# EAGLE design Matrix_keyboard (EAGLE 6.2)
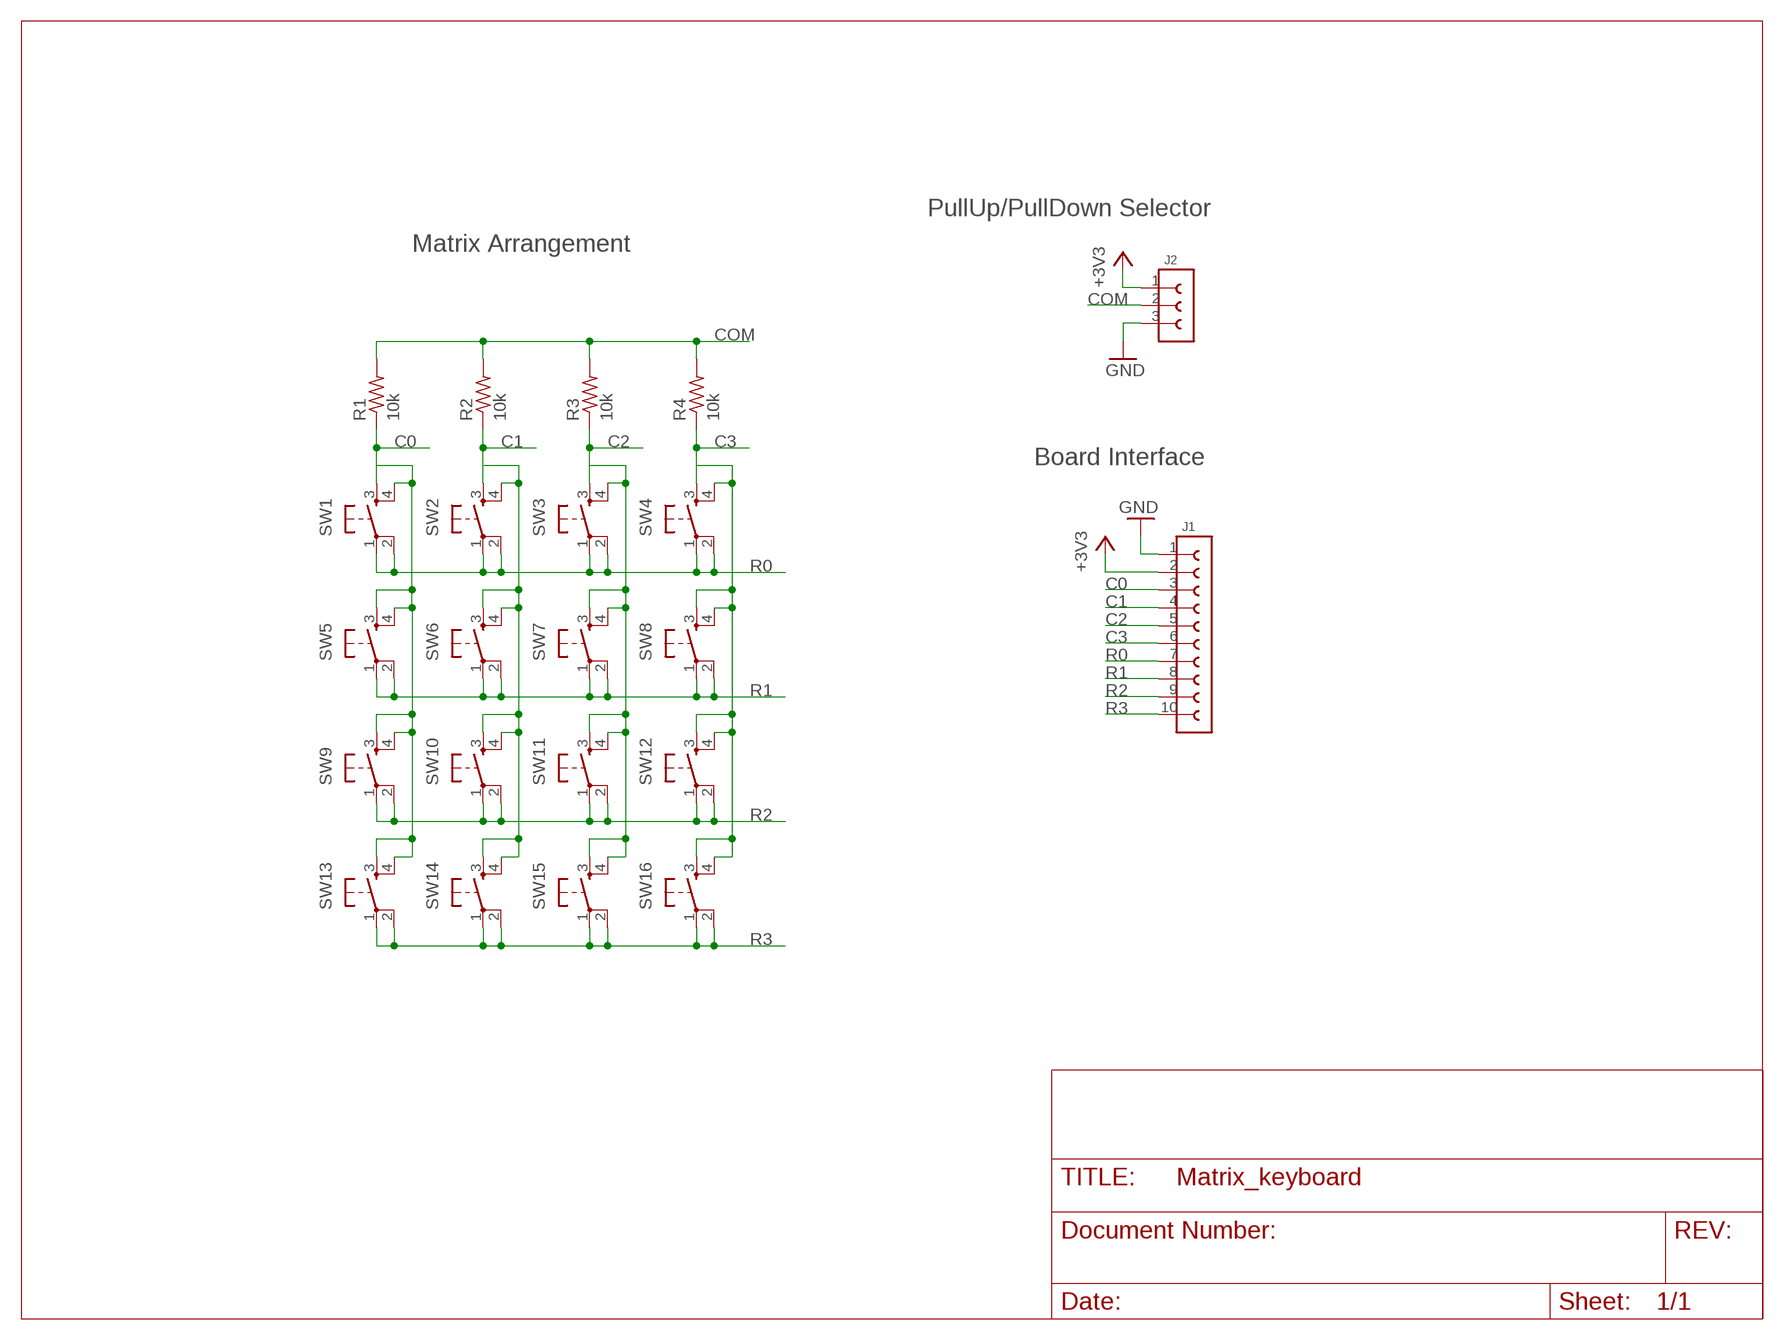
[diagram p0: schematic, sheet 1]

## Parts
J1  61301011121  [PHSP254P2540X254X1154-10S]
J2  61300311121  [PHSP254P762X254X1154-3S]
R1  10k  CRG0603F10K10  [RESC0603]
R2  10k  CRG0603F10K10  [RESC0603]
R3  10k  CRG0603F10K10  [RESC0603]
R4  10k  CRG0603F10K10  [RESC0603]
SW1  TL3301NF160QJ  [TACT600X600-4J]
SW2  TL3301NF160QJ  [TACT600X600-4J]
SW3  TL3301NF160QJ  [TACT600X600-4J]
SW4  TL3301NF160QJ  [TACT600X600-4J]
SW5  TL3301NF160QJ  [TACT600X600-4J]
SW6  TL3301NF160QJ  [TACT600X600-4J]
SW7  TL3301NF160QJ  [TACT600X600-4J]
SW8  TL3301NF160QJ  [TACT600X600-4J]
SW9  TL3301NF160QJ  [TACT600X600-4J]
SW10  TL3301NF160QJ  [TACT600X600-4J]
SW11  TL3301NF160QJ  [TACT600X600-4J]
SW12  TL3301NF160QJ  [TACT600X600-4J]
SW13  TL3301NF160QJ  [TACT600X600-4J]
SW14  TL3301NF160QJ  [TACT600X600-4J]
SW15  TL3301NF160QJ  [TACT600X600-4J]
SW16  TL3301NF160QJ  [TACT600X600-4J]

## Nets
+3V3: J1.2 J2.1
C0: J1.3 R1.P$1 SW1.3(S) SW1.4(S1) SW5.3(S) SW5.4(S1) SW9.3(S) SW9.4(S1) SW13.3(S) SW13.4(S1)
C1: J1.4 R2.P$1 SW2.3(S) SW2.4(S1) SW6.3(S) SW6.4(S1) SW10.3(S) SW10.4(S1) SW14.3(S) SW14.4(S1)
C2: J1.5 R3.P$1 SW3.3(S) SW3.4(S1) SW7.3(S) SW7.4(S1) SW11.3(S) SW11.4(S1) SW15.3(S) SW15.4(S1)
C3: J1.6 R4.P$1 SW4.3(S) SW4.4(S1) SW8.3(S) SW8.4(S1) SW12.3(S) SW12.4(S1) SW16.3(S) SW16.4(S1)
COM: J2.2 R1.P$2 R2.P$2 R3.P$2 R4.P$2
GND: J1.1 J2.3
R0: J1.7 SW1.1(P) SW1.2(P1) SW2.1(P) SW2.2(P1) SW3.1(P) SW3.2(P1) SW4.1(P) SW4.2(P1)
R1: J1.8 SW5.1(P) SW5.2(P1) SW6.1(P) SW6.2(P1) SW7.1(P) SW7.2(P1) SW8.1(P) SW8.2(P1)
R2: J1.9 SW9.1(P) SW9.2(P1) SW10.1(P) SW10.2(P1) SW11.1(P) SW11.2(P1) SW12.1(P) SW12.2(P1)
R3: J1.10 SW13.1(P) SW13.2(P1) SW14.1(P) SW14.2(P1) SW15.1(P) SW15.2(P1) SW16.1(P) SW16.2(P1)

## Notes on the sheet
- PullUp/PullDown Selector
- Matrix Arrangement
- Board Interface

## Library data of the parts
J1 = wurth-pin-socket-headers:6130101?: (10) 2.54mm Pin Header Description MATERIAL INSULATOR: PBT FLAMABILITY RATING: UL94-V0 COLOR: BLACK CONTACT MATERIAL: COPPER ALLOY CONTACT TYPE: STAMPED CONTACT PLATING: GOLD QUALITY CLASS: 3 AS PER CECC 75 301-802 PITCH: 2.54MM ENVIRONMENTAL OPERATING TEMPERATURE: -40 UP TO 125°C COMPLIANCE: LEAD FREE AND ROHS ELECTRICAL CURRENT RATING: 3A WORKING VOLTAGE: 250V AC INSULATOR RESISTANCE: >1000 MOHM DIELECTRIC WITHSTANDING VOLTAGE: 500V AC/MN CONTACT RESISTANCE: 20 mOHM MAX DIMENSION B = 2.54 x NB POSITIONS How to order Type Header/Socket Number of Positions Variation 613 = 2.54mm Pitch from 1 to 40 1121 = Pin Header Straigh Post 1021 = Pin Header Right Angle 1821 = Socket Header Straigh Post 43121 = Socket Header Right Angle Ref: Datasheet <http://katalog.we-online.de/em/datasheet/6130xx11121.pdf> , Datasheet <http://katalog.we-online.de/em/datasheet/6130xx11021.pdf> , Datasheet <http://katalog.we-online.de/em/datasheet/6130xx11821.pdf> , Datasheet <http://katalog.we-online.de/em/datasheet/6130xx143121.pdf>
J2 = wurth-pin-socket-headers:6130031?: (3) 2.54mm Pin Header Description MATERIAL INSULATOR: PBT FLAMABILITY RATING: UL94-V0 COLOR: BLACK CONTACT MATERIAL: COPPER ALLOY CONTACT TYPE: STAMPED CONTACT PLATING: GOLD QUALITY CLASS: 3 AS PER CECC 75 301-802 PITCH: 2.54MM ENVIRONMENTAL OPERATING TEMPERATURE: -40 UP TO 125°C COMPLIANCE: LEAD FREE AND ROHS ELECTRICAL CURRENT RATING: 3A WORKING VOLTAGE: 250V AC INSULATOR RESISTANCE: >1000 MOHM DIELECTRIC WITHSTANDING VOLTAGE: 500V AC/MN CONTACT RESISTANCE: 20 mOHM MAX DIMENSION B = 2.54 x NB POSITIONS How to order Type Header/Socket Number of Positions Variation 613 = 2.54mm Pitch from 1 to 40 1121 = Pin Header Straigh Post 1021 = Pin Header Right Angle 1821 = Socket Header Straigh Post 43121 = Socket Header Right Angle Ref: Datasheet <http://katalog.we-online.de/em/datasheet/6130xx11121.pdf> , Datasheet <http://katalog.we-online.de/em/datasheet/6130xx11021.pdf> , Datasheet <http://katalog.we-online.de/em/datasheet/6130xx11821.pdf> , Datasheet <http://katalog.we-online.de/em/datasheet/6130xx143121.pdf>
R1-R4 = te-fixed-resistors:CRG?*: Thick Film Chip Resistors 1% and 5% tolerance Description Precious metal terminations are screen printed onto a ceramic base and fired. The resistive element is screen printed and fired and the passivation layer added. Each resistor is trimmed to tolerance by laser. The pre-scribed tile is broken into strips, the end plating is fired on and the strips broken into individual components. Final termination is made by electroplating. Key Features Thick film resistors with a high power to size ratio,ideally suited to industrial and general purpose use. A range from 1 ohm to 10M and tolerances of 1% and 5%. Also including zero ohm links. Suitable for most applications, including high frequency operation, owing to the short lead structure and low capacitance. Seven Package Sizes Terminal finish: Matte Sn MSL Level 2 How to order Common Part Size Tolerance Resistance Value CRG - Thick Film Chip Resistor 0201 0402 0603 0805 1206 2512 F - ±1% J - ±5% 1 ohm (1 ohm) 1R0 1K ohm (1000 ohms) 1K 100K ohm (100000 ohms) 100K 1M ohm (1000000 ohms) 1M Ref: Datasheet <http://www.te.com/commerce/DocumentDelivery/DDEController?Action=showdoc&DocId=Data+Sheet%7F1773204%7FH%7Fpdf%7FEnglish%7FENG_DS_1773204_H.pdf%7F1623095-1>; AVRG-PRICE: 0.1; DATASHEET: http://www.te.com/commerce/DocumentDelivery/DDEController?Action=showdoc&DocId=Data+Sheet%7F1773204%7FH%7Fpdf%7FEnglish%7FENG_DS_1773204_H.pdf%7F1623095-1; DESCRIPTION: Resistores de película gruesa - SMD CRG0603 1% 10K 10KRL; EAGLEUP: RESC0603; MOUSER: 279-CRG0603F10K/10; OCTOPART-LINK: http://octopart.com/crg0603f10k10-tyco+electronics-16077289
SW1-SW16 = esw-tactile-sw:TL3301?*J: 6mm x 6mm Push Button, J lead Description Designed for SMT applications, each model has different features ranging from low profile designs, normally opened, right angle, and dual action. Applications include telecommunications, consumer electronics, audio/visual, medical devices, testing/instrumentation and computer/peripherals. SPECIFICATIONS: RATING: 50mA 12VDC MECHANICAL LIFE: ≥100,000 Cycles CONTACT RESISTANCE: 100mΩ Max. INSULATION RESISTANCE: 100MΩ Min. DIELECTRIC STRENGTH: 250VAC ACTUATION FORCE: 100gf ± 50gf; 160gf± 50gf; 260gf ± 50gf How to order Series Model Actuator Operating Force Contact Material Termination TL 3301 N = 4.3mm A = 5.0mm E = 7.3mm F = 7.0mm C = 8.0mm P = 8.5mm B = 9.5mm D =13.0mm F100 F160 F260 R - Gold Q - Silver J - J-lead Ref: Datasheet <http://www.e-switch.com/Portals/0/Series_Pdf/TL3301.pdf> Add more variants to TL3301@J, just remplace the "@" with a new technologie named according to order code parameters. It is mandatory to fill up the following attributes MANUFACTURER, DESCRIPTION, MOUSER, AVNET, ARROW, FUTURE, NEWARK, DIGIKEY, AVRG-PRICE, OCTOPART-LINK, DATASHEET; AVRG-PRICE: 0.41; DATASHEET: http://www.e-switch.com/Portals/0/Series_Pdf/TL3301.pdf; DESCRIPTION: Interruptores táctiles SMT Tact Switch SPST-NO 0.05A 12V J; DIGIKEY: EG4376TR-ND; EAGLEUP: TACT600X600X430-4J; MANUFACTURER: E-SWITCH; MOUSER: 612-TL3301NF160QJ; NEWARK: 15N4501; OCTOPART-LINK: http://octopart.com/tl3301nf160qj-e-switch-1252925

## Board
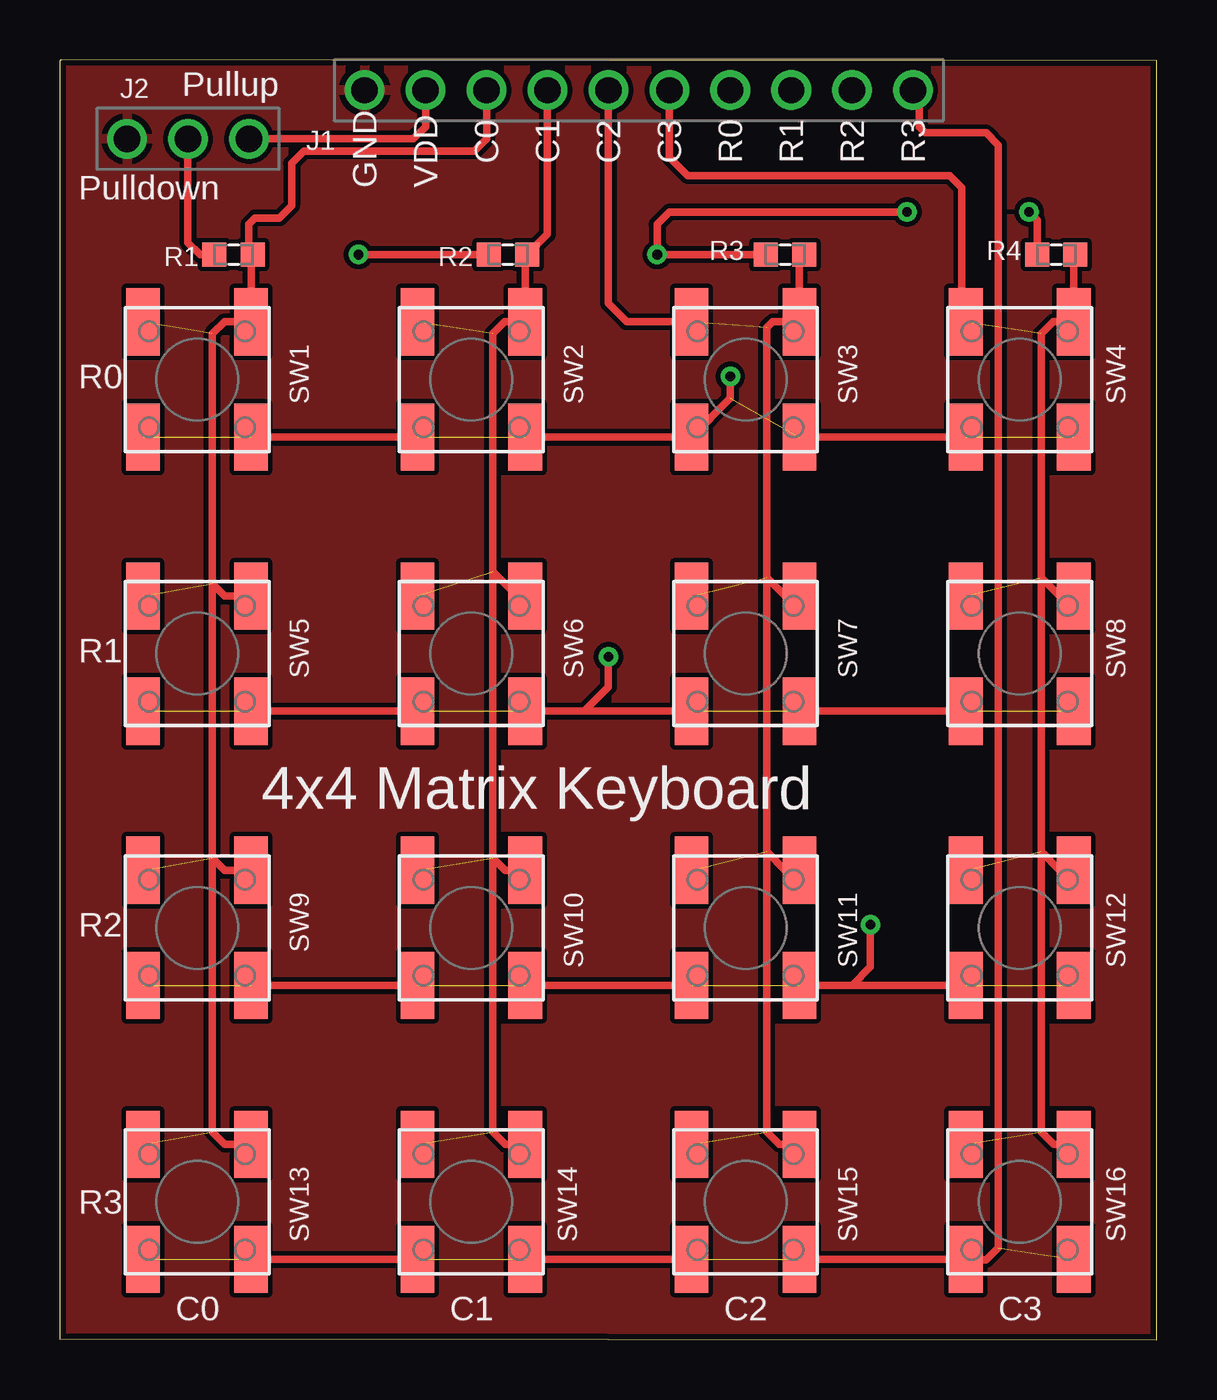
[diagram p1: board, top side]
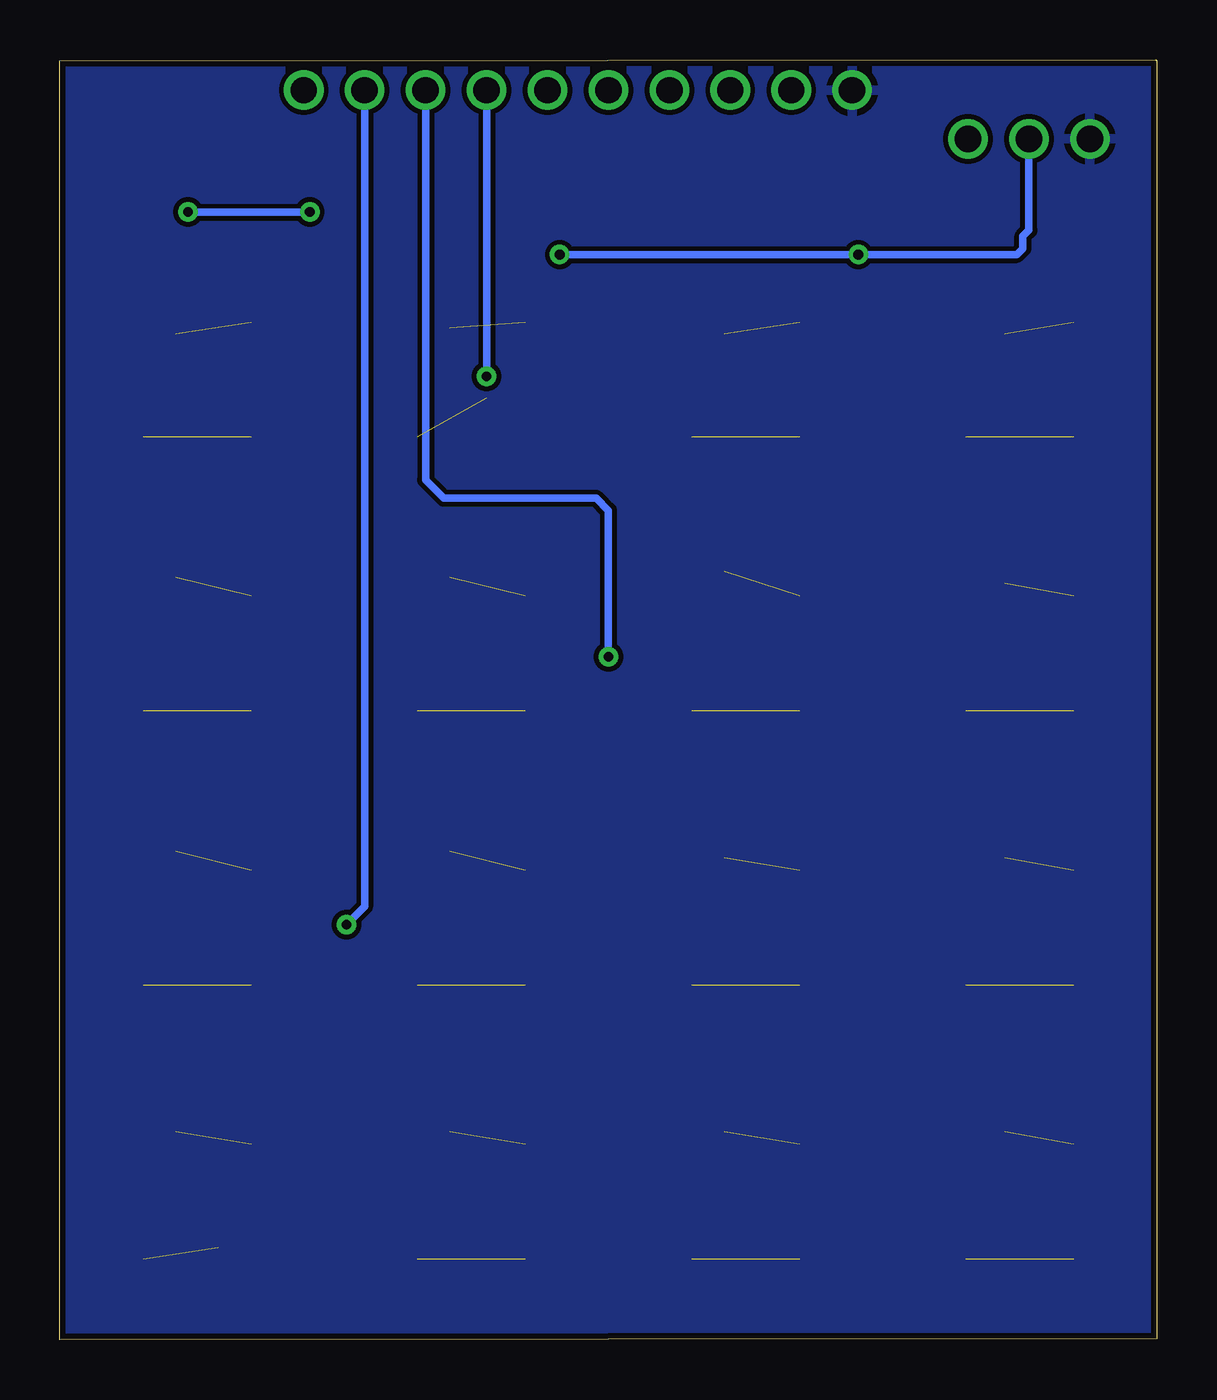
[diagram p2: board, bottom side, seen from below]

Size 45.72 x 53.36 mm. Coordinates in mm from the lower left corner, seen from the top.
Outline: 0,0.03 45.72,0 45.72,53.33 0.05,53.36 arc90 0,53.3 0,0.03
Copper layers (1*16): Top 0.035mm / dielectric 1.5mm / Bottom 0.035mm
Design rules: minimum track width 10mil, minimum drill 12mil, track to track 8mil, track to pad 8mil, pad to pad 8mil, via to via 8mil, smd to smd 8mil, copper to edge 10mil, drill to drill 8mil, minimum pad ring 10mil, minimum via ring 8mil, stop-mask expansion 4mil, vias tented up to drill 0mil, thermal gap 10mil

### Footprints (pad centres in the part's own frame; a part is rotated, then mirrored left to right if it is on the bottom)
PHSP254P2540X254X1154-10S = drill 1.1: 1 0,0; 2 2.54,0; 3 5.08,0; 4 7.62,0; 5 10.16,0; 6 12.7,0; 7 15.24,0; 8 17.78,0; 9 20.32,0; 10 22.86,0
PHSP254P762X254X1154-3S = drill 1.1: 1 0,0; 2 2.54,0; 3 5.08,0
RESC0603 = smd 1 x 1: P$1 0.8,0; P$2 -0.8,0
TACT600X600-4J = smd 1.4 x 2.8: 1 -2.25,2.4; 2 2.25,2.4; 3 2.25,-2.4; 4 -2.25,-2.4

### Placement (x,y rotation side)
J1  12.7,52.1 0 top
J2  7.87,50.06 180 top
R1  7.24,45.24 0 top
R2  18.67,45.24 0 top
R3  30.23,45.24 0 top
R4  41.53,45.24 0 top
SW1  5.71,40.03 180 top
SW2  17.14,40.03 180 top
SW3  28.57,40.03 180 top
SW4  40.01,40.03 180 top
SW5  5.71,28.6 180 top
SW6  17.14,28.6 180 top
SW7  28.57,28.6 180 top
SW8  40.01,28.6 180 top
SW9  5.71,17.17 180 top
SW10  17.14,17.17 180 top
SW11  28.57,17.17 180 top
SW12  40.01,17.17 180 top
SW13  5.71,5.74 180 top
SW14  17.14,5.74 180 top
SW15  28.57,5.74 180 top
SW16  40.01,5.74 180 top

### Tracks (layer width: path | path; a pad name or v marks a point on that pad's centre or on a via)
+3V3
  Top 0.305: J2.1 14.73,50.06 15.24,50.57 J1.2
C0  (4 unrouted)
  Top 0.305: J1.3 17.78,50.06 17.27,49.56 10.16,49.56 9.65,49.05 9.65,47.27 9.14,46.76 8.13,46.76 7.87,46.51 7.87,45.4 R1.P$1 7.96,45.16 SW1.4 6.86,42.44 6.35,41.94 6.35,31.52 | SW13.4 6.87,8.14 6.35,8.66 6.35,20.09 | 6.35,20.09 6.35,31.52 | SW5.4 6.87,31 6.35,31.52 | SW9.4 6.87,19.57 6.35,20.09
C1  (4 unrouted)
  Top 0.305: J1.4 20.32,46.09 R2.P$1 19.39,45.16 SW2.4 18.54,42.44 18.03,41.94 18.03,32.03 | SW14.4 18.55,8.14 18.03,8.66 18.03,20.09 | 18.03,20.09 18.03,32.03 | SW10.4 18.55,19.57 18.03,20.09 | SW6.4 19.06,31 18.03,32.03
C2  (4 unrouted)
  Top 0.305: R3.P$1 30.82,45.04 SW3.4 29.72,42.44 29.46,42.19 29.46,31.78 | J1.5 22.86,43.21 23.62,42.44 SW3.3 | SW15.4 29.98,8.14 29.46,8.66 29.46,20.35 | 29.46,20.35 29.46,31.78 | SW7.4 30.24,31 29.46,31.78 | SW11.4 30.24,19.57 29.46,20.35
C3  (4 unrouted)
  Top 0.305: R4.P$1 42.26,45.04 SW4.4 42.24,42.44 41.4,42.44 40.89,41.94 40.89,31.78 | SW16.4 41.41,8.14 40.89,8.66 40.89,20.35 | 40.89,20.35 40.89,31.78 | SW8.4 41.67,31 40.89,31.78 | SW12.4 41.67,19.57 40.89,20.35 | J1.6 25.4,49.3 26.16,48.54 37.08,48.54 37.59,48.03 37.59,42.59 SW4.3
COM  (via drill 0.41)
  Top 0.305: J2.2 5.33,45.75 5.84,45.24 R1.P$2 | R2.P$2 v12.45,45.24 | R3.P$2 v24.89,45.24 24.89,46.51 25.4,47.02 v35.31,47.02 | R4.P$2 40.73,46.67 v40.39,47.02
  Bottom 0.305: J2.2 5.33,46.25 5.59,46 5.59,45.49 5.84,45.24 v12.45,45.24 v24.89,45.24 | v40.39,47.02 v35.31,47.02
GND
  pour Top: 0,0.03 0,53.31 arc-90 0.05,53.37 45.72,53.37 45.72,0.03
  pour Bottom: 0,0.03 0,53.31 arc-90 0.05,53.37 45.72,53.37 45.72,0.03
R0  (via drill 0.41)  (4 unrouted)
  Top 0.305: SW1.1 SW2.2 | SW2.1 SW3.2 27.94,39.25 v27.94,40.16 | SW3.1 SW4.2
  Bottom 0.305: J1.7 v27.94,40.16
R1  (via drill 0.41)  (4 unrouted)
  Top 0.305: SW5.1 SW6.2 | SW6.1 21.84,26.2 | 21.84,26.2 SW7.2 | SW7.1 SW8.2 | v22.86,28.47 22.86,27.22 21.84,26.2
  Bottom 0.305: J1.8 30.48,35.84 29.72,35.08 23.37,35.08 22.86,34.57 v22.86,28.47
R2  (via drill 0.41)  (4 unrouted)
  Top 0.305: SW9.1 SW10.2 | SW10.1 SW11.2 | SW11.1 33.02,14.77 | 33.02,14.77 SW12.2 | v33.78,17.3 33.78,15.53 33.02,14.77
  Bottom 0.305: J1.9 33.02,18.06 v33.78,17.3
R3  (4 unrouted)
  Top 0.305: SW13.1 SW14.2 | SW14.1 SW15.2 | SW15.1 SW16.2 38.61,3.33 39.12,3.84 39.12,49.81 38.61,50.32 36.07,50.32 35.81,50.57 35.81,51.84 J1.10

### Text on the board
tPlace: Pullup | C0 | C1 | C2 | C3 | R0 | R1 | R2 | R3 | GND | VDD | Pulldown | R0 | R1 | 4x4 Matrix Keyboard | R2 | R3 | C0 | C1 | C2 | C3